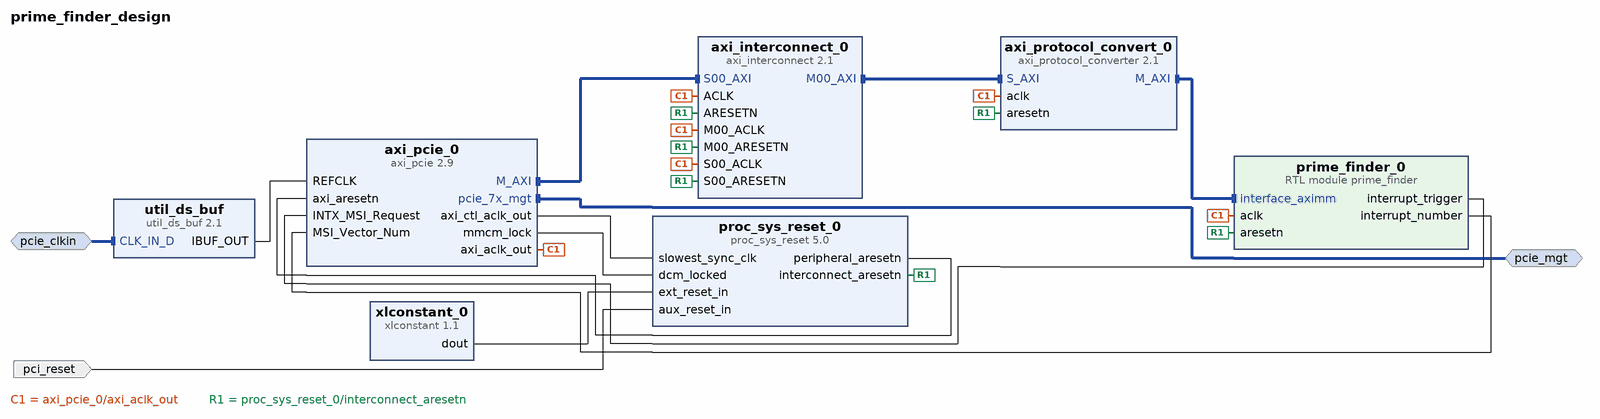
[diagram p0: block diagram of the top level]
# Vivado block design prime_finder_design, xc7a100tfgg484-2L, Vivado 2020.1
create_bd_design prime_finder_design

create_bd_intf_port -mode Slave -vlnv xilinx.com:interface:diff_clock_rtl:1.0 pcie_clkin
set_property -dict {CONFIG.FREQ_HZ 100000000} [get_bd_intf_ports pcie_clkin]
create_bd_intf_port -mode Master -vlnv xilinx.com:interface:pcie_7x_mgt_rtl:1.0 pcie_mgt
create_bd_port -dir I -type rst pci_reset
set_property -dict {CONFIG.POLARITY ACTIVE_LOW} [get_bd_ports pci_reset]

create_bd_cell -type ip -vlnv xilinx.com:ip:axi_interconnect:2.1 axi_interconnect_0
set_property -dict {CONFIG.ENABLE_ADVANCED_OPTIONS 1 CONFIG.NUM_MI 1} [get_bd_cells axi_interconnect_0]
create_bd_cell -type ip -vlnv xilinx.com:ip:axi_pcie:2.9 axi_pcie_0
set_property -dict [list \
  CONFIG.AXIBAR2PCIEBAR_0 0x40000000 \
  CONFIG.AXIBAR_AS_0 false \
  CONFIG.AXIBAR_NUM 1 \
  CONFIG.BAR1_ENABLED false \
  CONFIG.BAR1_SCALE N/A \
  CONFIG.BAR1_SIZE 8 \
  CONFIG.BAR1_TYPE N/A \
  CONFIG.DEVICE_ID 0x7014 \
  CONFIG.INTERRUPT_PIN true \
  CONFIG.MAX_LINK_SPEED 2.5_GT/s \
  CONFIG.M_AXI_DATA_WIDTH 64 \
  CONFIG.NO_OF_LANES X4 \
  CONFIG.PCIEBAR2AXIBAR_0 0x40000000 \
  CONFIG.S_AXI_DATA_WIDTH 64 \
] [get_bd_cells axi_pcie_0]
create_bd_cell -type ip -vlnv xilinx.com:ip:axi_protocol_converter:2.1 axi_protocol_convert_0
create_bd_cell -type ip -vlnv xilinx.com:ip:proc_sys_reset:5.0 proc_sys_reset_0
set_property -dict {CONFIG.C_AUX_RESET_HIGH 0} [get_bd_cells proc_sys_reset_0]
create_bd_cell -type ip -vlnv xilinx.com:ip:util_ds_buf:2.1 util_ds_buf
set_property -dict {CONFIG.C_BUF_TYPE IBUFDSGTE} [get_bd_cells util_ds_buf]
create_bd_cell -type ip -vlnv xilinx.com:ip:xlconstant:1.1 xlconstant_0
create_bd_cell -type module -reference prime_finder prime_finder_0

# ---- connections ----

connect_bd_intf_net [get_bd_intf_pins axi_protocol_convert_0/S_AXI] [get_bd_intf_pins axi_interconnect_0/M00_AXI]
connect_bd_intf_net -intf_net axi_pcie_0_M_AXI [get_bd_intf_pins axi_pcie_0/M_AXI] [get_bd_intf_pins axi_interconnect_0/S00_AXI]
connect_bd_intf_net [get_bd_intf_ports pcie_clkin] [get_bd_intf_pins util_ds_buf/CLK_IN_D]
connect_bd_intf_net [get_bd_intf_ports pcie_mgt] [get_bd_intf_pins axi_pcie_0/pcie_7x_mgt]
connect_bd_intf_net [get_bd_intf_pins prime_finder_0/interface_aximm] [get_bd_intf_pins axi_protocol_convert_0/M_AXI]
connect_bd_net [get_bd_pins axi_pcie_0/axi_aclk_out] \
  [get_bd_pins axi_interconnect_0/ACLK] [get_bd_pins axi_interconnect_0/S00_ACLK] [get_bd_pins axi_interconnect_0/M00_ACLK] \
  [get_bd_pins axi_protocol_convert_0/aclk] [get_bd_pins prime_finder_0/aclk]
connect_bd_net [get_bd_pins axi_pcie_0/axi_ctl_aclk_out] [get_bd_pins proc_sys_reset_0/slowest_sync_clk]
connect_bd_net [get_bd_pins axi_pcie_0/mmcm_lock] [get_bd_pins proc_sys_reset_0/dcm_locked]
connect_bd_net [get_bd_ports pci_reset] [get_bd_pins proc_sys_reset_0/aux_reset_in]
connect_bd_net [get_bd_pins proc_sys_reset_0/interconnect_aresetn] \
  [get_bd_pins axi_interconnect_0/ARESETN] [get_bd_pins axi_interconnect_0/S00_ARESETN] \
  [get_bd_pins axi_interconnect_0/M00_ARESETN] [get_bd_pins axi_protocol_convert_0/aresetn] \
  [get_bd_pins prime_finder_0/aresetn]
connect_bd_net [get_bd_pins proc_sys_reset_0/peripheral_aresetn] [get_bd_pins axi_pcie_0/axi_aresetn]
connect_bd_net [get_bd_pins util_ds_buf/IBUF_OUT] [get_bd_pins axi_pcie_0/REFCLK]
connect_bd_net [get_bd_pins xlconstant_0/dout] [get_bd_pins proc_sys_reset_0/ext_reset_in]
connect_bd_net [get_bd_pins prime_finder_0/interrupt_trigger] [get_bd_pins axi_pcie_0/INTX_MSI_Request]
connect_bd_net [get_bd_pins prime_finder_0/interrupt_number] [get_bd_pins axi_pcie_0/MSI_Vector_Num]
set_property HDL_ATTRIBUTE.DEBUG true [get_bd_intf_nets axi_pcie_0_M_AXI]
set_property HDL_ATTRIBUTE.MARK_DEBUG true [get_bd_intf_nets axi_pcie_0_M_AXI]

# ---- address map ----
assign_bd_address -offset 0x40000000 -range 64K -target_address_space [get_bd_addr_spaces axi_pcie_0/M_AXI] [get_bd_addr_segs prime_finder_0/interface_aximm/reg0]

validate_bd_design
save_bd_design
